# Altium schematic sheet Transmitter_PCB.SchDoc
size A4
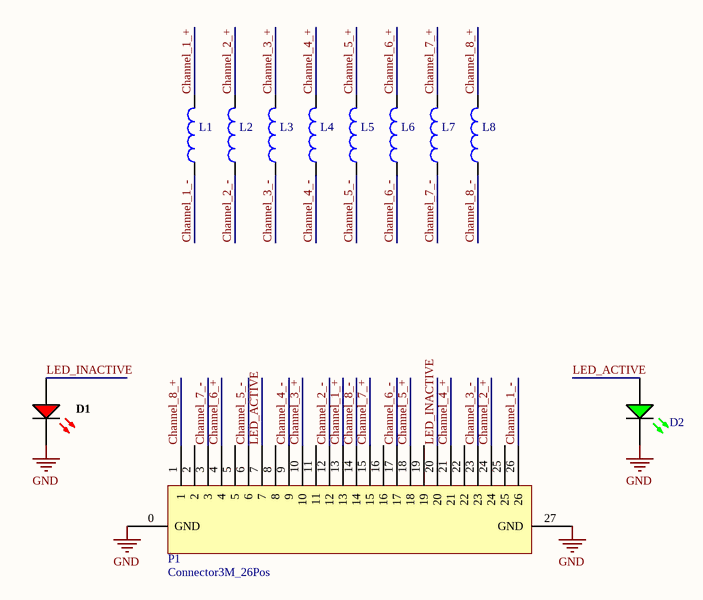
[diagram p0: Transmitter_PCB.SchDoc]

## Parts
D1  KPA-3010SECK-J3  [KING-LED2107-13-RED-2_V]  (value not drawn)
D2  KPA-3010ZGCK  [KING-LED2107-13-RED-2_V]  (value not drawn)
L1  (no value)  [TRANSMITTER_COIL_UCC_ORIGINAL]
L2  (no value)  [TRANSMITTER_COIL_UCC_ORIGINAL]
L3  (no value)  [TRANSMITTER_COIL_UCC_ORIGINAL]
L4  (no value)  [TRANSMITTER_COIL_UCC_ORIGINAL]
L5  (no value)  [TRANSMITTER_COIL_UCC_ORIGINAL]
L6  (no value)  [TRANSMITTER_COIL_UCC_ORIGINAL]
L7  (no value)  [TRANSMITTER_COIL_UCC_ORIGINAL]
L8  (no value)  [TRANSMITTER_COIL_UCC_ORIGINAL]
P1  Connector3M_26Pos  [Connector_3M_26Pos]

## Nets
GND: D1.1(K) D2.1(K) P1.0(GND) P1.27(GND)
Channel_1_+: L1.2 P1.13
Channel_1_-: L1.1 P1.26
Channel_2_+: L2.2 P1.24
Channel_2_-: L2.1 P1.12
Channel_3_+: L3.2 P1.10
Channel_3_-: L3.1 P1.23
Channel_4_+: L4.2 P1.21
Channel_4_-: L4.1 P1.9
Channel_5_+: L5.2 P1.18
Channel_5_-: L5.1 P1.6
Channel_6_+: L6.2 P1.4
Channel_6_-: L6.1 P1.17
Channel_7_+: L7.2 P1.15
Channel_7_-: L7.1 P1.3
Channel_8_+: L8.2 P1.1
Channel_8_-: L8.1 P1.14
LED_ACTIVE: D2.2(A) P1.7
LED_INACTIVE: D1.2(A) P1.20

Not connected (* = marked no-connect by the designer): P1 2 5 8 11 16 19 22 25

## Library data of the parts
D1 = KPA-3010SECK-J3: KINGBRIGHT - KPA-3010SECK-J3 - LED, 1104, RIGHT AN., RED, 380MCD; Supplier 1: Farnell; Manufacturer: KINGBRIGHT; Manufacturer Part Number: KPA-3010SECK-J3; RoHS: YES; Stock 1: 16201; Pricing 1: 1=0.274, 10=0.249, 50=0.23, 100=0.212, 250=0.202, 500=0.193, 900=0.187, 3000=0.181 (EUR); ComponentLink1URL: http://www.farnell.com/datasheets/2045660.pdf; ComponentLink1Description: http://www.farnell.com/datasheets/2045660.pdf; Supplier Part Number 1: 2335820
D2 = KPA-3010ZGCK: KINGBRIGHT - KPA-3010ZGCK - LED, 3MM, GREEN, 300MCD, 525NM; Supplier 1: Farnell; Manufacturer: KINGBRIGHT; Manufacturer Part Number: KPA-3010ZGCK; RoHS: YES; Stock 1: 1377; Pricing 1: 1=0.285, 10=0.26, 50=0.241, 100=0.222, 500=0.209, 900=0.2, 3000=0.194, 9000=0.187 (EUR); ComponentLink1URL: http://www.farnell.com/datasheets/2045683.pdf; ComponentLink1Description: http://www.farnell.com/datasheets/2045683.pdf; Supplier Part Number 1: 2373514
L1-L8 = TRANSMITTER_COIL_UCC_ORIGINAL
P1 = Connector3M_26Pos: Published: 8-Jun-2000; LatestRevisionDate: 23-02-1017; LatestRevisionNote: IPC-7351 Footprint Added.; PackageReference: J1-0603; Publisher: Altium Limited; PackageDescription: Connector